# EAGLE schematic iotkit-esp32 (EAGLE 9.6.2)
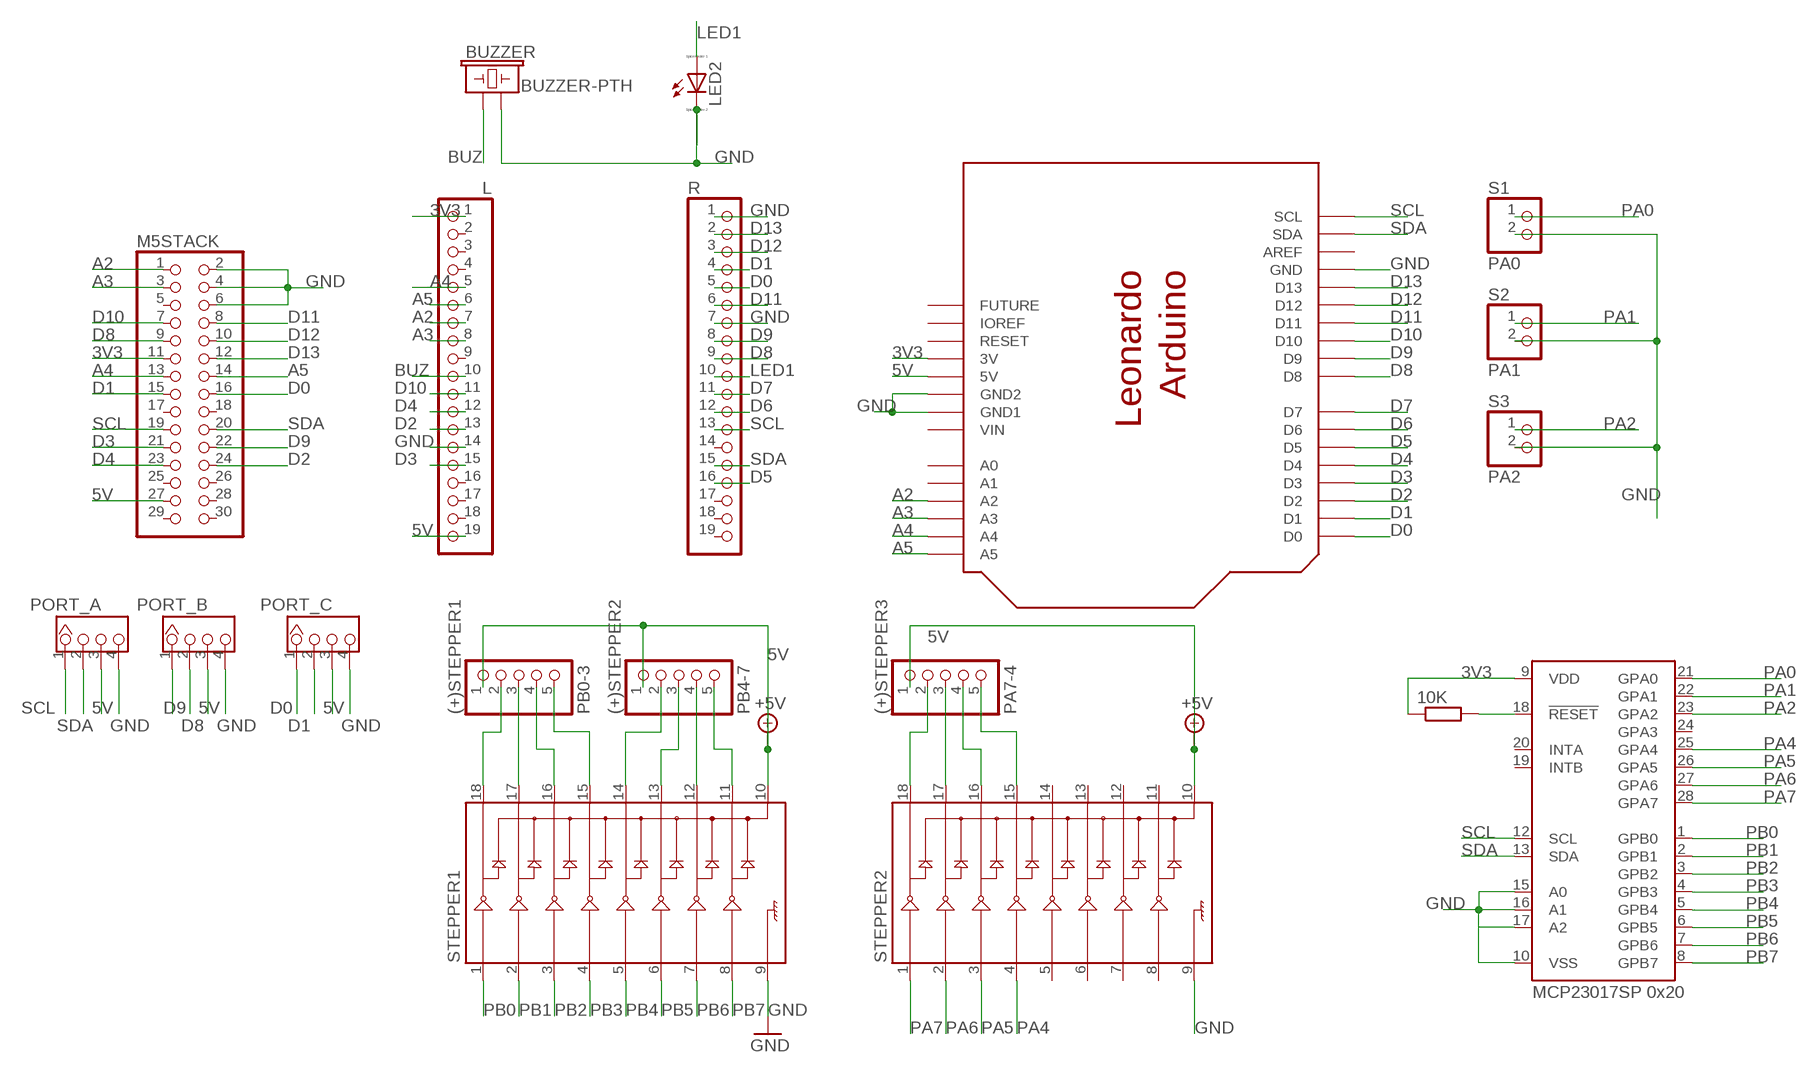
[diagram p0: schematic, sheet 1]

## Parts
10K  R-EU_0204/7  [0204/7]
(+)STEPPER1  PB0-3  PINHD-1X5  [1X05]
(+)STEPPER2  PB4-7  PINHD-1X5  [1X05]
(+)STEPPER3  PA7-4  PINHD-1X5  [1X05]
BUZZER  BUZZER-PTH  [BUZZER-12MM]
IC1  MCP23017SP 0x20  MCP23017SP  [DIL28-3]
L  PINHD-1X19  [1X19]
LED2  LED_ELD260  [LED_LD260]
M5STACK  PINHD-2X15  [2X15]
PORT_A  I2C  GROVE-CONNECTOR-DIP(4P-2.0)  [HW4-2.0]
PORT_B  I2C  GROVE-CONNECTOR-DIP(4P-2.0)  [HW4-2.0]
PORT_C  I2C  GROVE-CONNECTOR-DIP(4P-2.0)  [HW4-2.0]
R  PINHD-1X19  [1X19]
S1  PA0  PINHD-1X2  [1X02]
S2  PA1  PINHD-1X2  [1X02]
S3  PA2  PINHD-1X2  [1X02]
STEPPER1  ULN2803DIP  [DIL18]
STEPPER2  ULN2803DIP  [DIL18]
U$1  ARDUINO_LEONARDO  [ARDUINO_LEONARDO]

## Nets
3V3: 10K.1 IC1.9(VDD) L.1 M5STACK.11 U$1.3V
5V: (+)STEPPER1.1 (+)STEPPER2.1 (+)STEPPER3.1 L.19 M5STACK.27 PORT_A.3 PORT_B.3 PORT_C.3 STEPPER1.10 STEPPER2.10 U$1.5V ; supply symbol labelled +5V
A2: L.7 M5STACK.1 U$1.A2
A3: L.8 M5STACK.3 U$1.A3
A4: L.5 M5STACK.13 U$1.A4
A5: L.6 M5STACK.14 U$1.A5
BUZ: BUZZER.+ L.10
D0: M5STACK.16 PORT_C.1 R.5 U$1.D0
D1: M5STACK.15 PORT_C.2 R.4 U$1.D1
D2: L.13 M5STACK.24 U$1.D2
D3: L.15 M5STACK.21 U$1.D3
D4: L.12 M5STACK.23 U$1.D4
D5: R.16 U$1.D5
D6: R.12 U$1.D6
D7: R.11 U$1.D7
D8: M5STACK.9 PORT_B.2 R.9 U$1.D8
D9: M5STACK.22 PORT_B.1 R.8 U$1.D9
D10: L.11 M5STACK.7 U$1.D10
D11: M5STACK.8 R.6 U$1.D11
D12: M5STACK.10 R.3 U$1.D12
D13: M5STACK.12 R.2 U$1.D13
GND: BUZZER.- IC1.10(VSS) IC1.15(A0) IC1.16(A1) IC1.17(A2) L.14 LED2.K(C) M5STACK.2 M5STACK.4 M5STACK.6 PORT_A.4 PORT_B.4 PORT_C.4 R.1 R.7 S1.2 S2.2 S3.2 STEPPER1.9 STEPPER2.9 U$1.GND U$1.GND$2(GND2) U$1.GND$3(GND1)
LED1: LED2.A R.10
N$1: (+)STEPPER2.2 STEPPER1.14
N$2: (+)STEPPER2.3 STEPPER1.13
N$3: (+)STEPPER2.4 STEPPER1.12
N$4: (+)STEPPER2.5 STEPPER1.11
N$5: 10K.2 IC1.18(!RESET)
N$6: (+)STEPPER3.2 STEPPER2.18
N$7: (+)STEPPER3.3 STEPPER2.17
N$8: (+)STEPPER3.4 STEPPER2.16
N$9: (+)STEPPER3.5 STEPPER2.15
N$30: (+)STEPPER1.2 STEPPER1.18
N$31: (+)STEPPER1.3 STEPPER1.17
N$32: (+)STEPPER1.4 STEPPER1.16
N$33: (+)STEPPER1.5 STEPPER1.15
PA0: IC1.21(GPA0) S1.1
PA1: IC1.22(GPA1) S2.1
PA2: IC1.23(GPA2) S3.1
PA4: IC1.25(GPA4) STEPPER2.4
PA5: IC1.26(GPA5) STEPPER2.3
PA6: IC1.27(GPA6) STEPPER2.2
PA7: IC1.28(GPA7) STEPPER2.1
PB0: IC1.1(GPB0) STEPPER1.1
PB1: IC1.2(GPB1) STEPPER1.2
PB2: IC1.3(GPB2) STEPPER1.3
PB3: IC1.4(GPB3) STEPPER1.4
PB4: IC1.5(GPB4) STEPPER1.5
PB5: IC1.6(GPB5) STEPPER1.6
PB6: IC1.7(GPB6) STEPPER1.7
PB7: IC1.8(GPB7) STEPPER1.8
SCL: IC1.12(SCL) M5STACK.19 PORT_A.1 R.13 U$1.SCL
SDA: IC1.13(SDA) M5STACK.20 PORT_A.2 R.15 U$1.SDA
Unconnected: IC1.19(INTB) IC1.20(INTA) IC1.24(GPA3) L.2 L.3 L.4 L.9 L.16 L.17 L.18 M5STACK.5 M5STACK.17 M5STACK.18 M5STACK.25 M5STACK.26 M5STACK.28 M5STACK.29 M5STACK.30 R.14 R.17 R.18 R.19 STEPPER2.5 STEPPER2.6 STEPPER2.7 STEPPER2.8 STEPPER2.11 STEPPER2.12 STEPPER2.13 STEPPER2.14 U$1.A0 U$1.A1 U$1.AREF U$1.IOREF U$1.RESERVED(FUTURE) U$1.RESET

## Power pins joined to a net without a drawn wire
VIN: U$1.VIN

## Library data of the parts
10K = rcl:R-EU_: RESISTOR, European symbol; SPICEPREFIX: R
(+)STEPPER1-(+)STEPPER3 = pinhead:PINHD-1X5: PIN HEADER
BUZZER = SparkFun-Electromechanical:BUZZER: Buzzer Small round buzzers that operate around the audible 2kHz range. You can use these as speakers to create simple music or user interfaces. Variant Overview: PTH - Mini Speaker - PC Mount 12mm 2.048kHz <https://www.sparkfun.com/products/7950> PTH_KIT - Mini Speaker - PC Mount 12mm 2.048kHz <https://www.sparkfun.com/products/7950> KIT simplifies soldering by adding stop mask to one side of the pads. PTH_NO_SILK - Mini Speaker - PC Mount 12mm 2.048kHz <https://www.sparkfun.com/products/7950> No silkscreen indicator of buzzer outline. PTH_KIT_NO_SILK - Mini Speaker - PC Mount 12mm 2.048kHz <https://www.sparkfun.com/products/7950> KIT package w/o silkscreen SMD - Buzzer Audio Magnetic (CCV-084B16) SMD buzzer used on, e.g. the LilyPad Buzzer <https://www.sparkfun.com/products/8463> and RFID USB Reader <https://www.sparkfun.com/products/9963>. SMD_KIT - Buzzer Audio Magnetic (CCV-084B16) SMD Buzzer with elongated pins to make soldering easier. Used on the SparkFun Simon Says - Surface Mount Soldering Kit <https://www.sparkfun.com/products/10935>.; PROD_ID: COMP-08253; SF_SKU: COM-07950
IC1 = microchip:MCP23017: http://ww1.microchip.com/downloads/en/DeviceDoc/21952a.pdf Source: http://ww1.microchip.com/downloads/en/DeviceDoc/21952a.pdf; MF: MICROCHIP; MPN: MCP23017-E/SP; OC_FARNELL: 1332088; OC_NEWARK: 31K2959
L R = pinhead:PINHD-1X19: PIN HEADER
LED2 = eagle-ltspice:LED_E: LED Source: http://www.osram.convergy.de Source: www.luxeon.com Source: www.kingbright.com; SPICEMODEL: NONE; SPICEPREFIX: D; SPICETYPE: diode
M5STACK = pinhead:PINHD-2X15: PIN HEADER
PORT_A PORT_B PORT_C = Seeed-Connector:GROVE-CONNECTOR-DIP(4P-2.0): 320110033; VALUE: 4P-2.0
S1-S3 = pinhead:PINHD-1X2: PIN HEADER
STEPPER1 STEPPER2 = SparkFun-IC-Special-Function:ULN2803: Darlington Driver(IC-07959, low stock) ULN2803 Darlington array. 500mA max per channel, 8-channel package. Spark Fun Electronics SKU : COM-00312
U$1 = srg:ARDUINO_LEONARDO: Arduino Leonardo I2C Pins: D2, D3 PWM Pins: D3, D5, D5, D11, D13 Interrup Pint: D2, D3 http://arduino.cc/en/Main/arduinoBoardLeonardo